# EAGLE design V1_EG7 (EAGLE 7.7.0)
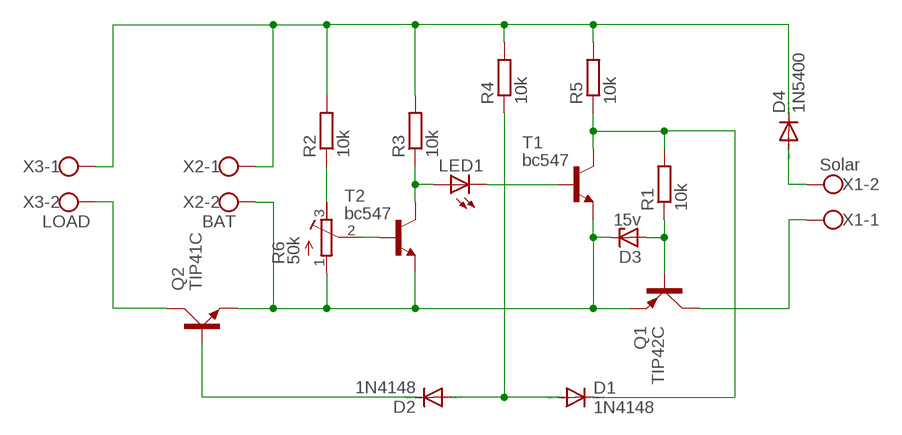
[diagram p0: schematic, sheet 1]

## Parts
D1  1N4148  1N4148DO35-10  [DO35-10]
D2  1N4148  1N4148DO35-10  [DO35-10]
D3  15v  ZENER-DIODEZD-10  [ZDIO-10]
D4  1N5400  [DO201-15]
LED1  LED5MM  [LED5MM]
Q1  TIP42C  [TO220AV]
Q2  TIP41C  [TO220AV]
R1  10k  R-EU_0207/10  [0207/10]
R2  10k  R-EU_0207/10  [0207/10]
R3  10k  R-EU_0207/10  [0207/10]
R4  10k  R-EU_0207/10  [0207/10]
R5  10k  R-EU_0207/10  [0207/10]
R6  50k  R-TRIMM64W  [RTRIM64W]
T1  bc547  BC547-NPN-TO92-CBE  [TO92-CBE]
T2  bc547  BC547-NPN-TO92-CBE  [TO92-CBE]
X1  Solar  W237-102  [W237-102]
X2  BAT  W237-102  [W237-102]
X3  LOAD  W237-102  [W237-102]

## Nets
GND: D3.C Q1.E Q2.E R6.1(A) T1.E T2.E X2.2
N$1: R6.2(S) T2.B
N$2: R2.1 R6.3(E)
N$4: LED1.A R3.1 T2.C
N$5: LED1.K(C) T1.B
N$6: D1.C R1.2 R5.1 T1.C
N$7: D3.A Q1.B R1.1
N$9: D1.A D2.A R4.1
N$10: Q2.C X3.2
N$11: Q1.C X1.1
N$12: D2.C Q2.B
N$13: D4.C R2.2 R3.2 R4.2 R5.2 X2.1 X3.1
N$16: D4.A X1.2

## Library data of the parts
D1 D2 = diode:1N4148: DIODE high speed (Philips)
D3 = diode:ZENER-DIODE: Z-Diode
D4 = diode:1N5400: DIODE standard rectifier, 3 A, 50 V (Motorola)
LED1 = adafruit:LED: LED OSRAM: - CHIPLED LG R971, LG N971, LY N971, LG Q971, LY Q971, LO R971, LY R971 LH N974, LH R974 LS Q976, LO Q976, LY Q976 LO Q996 - Hyper CHIPLED LW Q18S LB Q993, LB Q99A, LB R99A - SideLED LS A670, LO A670, LY A670, LG A670, LP A670 LB A673, LV A673, LT A673, LW A673 LH A674 LY A675 LS A676, LA A676, LO A676, LY A676, LW A676 LS A679, LY A679, LG A679 - Hyper Micro SIDELED® LS Y876, LA Y876, LO Y876, LY Y876 LT Y87S - SmartLED LW L88C, LW L88S LB L89C, LB L89S, LG L890 LS L89K, LO L89K, LY L89K LS L896, LA L896, LO L896, LY L896 - TOPLED LS T670, LO T670, LY T670, LG T670, LP T670 LSG T670, LSP T670, LSY T670, LOP T670, LYG T670 LG T671, LOG T671, LSG T671 LB T673, LV T673, LT T673, LW T673 LH T674 LS T676, LA T676, LO T676, LY T676, LB T676, LH T676, LSB T676, LW T676 LB T67C, LV T67C, LT T67C, LS T67K, LO T67K, LY T67K, LW E67C LS E67B, LA E67B, LO E67B, LY E67B, LB E67C, LV E67C, LT E67C LW T67C LS T679, LY T679, LG T679 LS T770, LO T770, LY T770, LG T770, LP T770 LB T773, LV T773, LT T773, LW T773 LH T774 LS E675, LA E675, LY E675, LS T675 LS T776, LA T776, LO T776, LY T776, LB T776 LHGB T686 LT T68C, LB T68C - Hyper Mini TOPLED® LB M676 - Mini TOPLED Santana® LG M470 LS M47K, LO M47K, LY M47K Source: http://www.osram.convergy.de/
Q1 = transistor-power:TIP42C: PNP TRANSISTOR
Q2 = transistor-power:TIP41C: NPN TRANSISTOR
R1-R5 = rcl:R-EU_: RESISTOR, European symbol; SPICEPREFIX: R
R6 = rcl:R-TRIMM: Trimm resistor; SPICEMODEL: X; SPICEPREFIXL: POT
T1 T2 = DC_LOAD_AU:*-NPN-: NPN Transistror BF959 corrected 2008.03.06
X1-X3 = con-wago-500:W237-102: WAGO SCREW CLAMP; MPN: 237-102; OC_FARNELL: unknown; OC_NEWARK: 70K9898

## Board
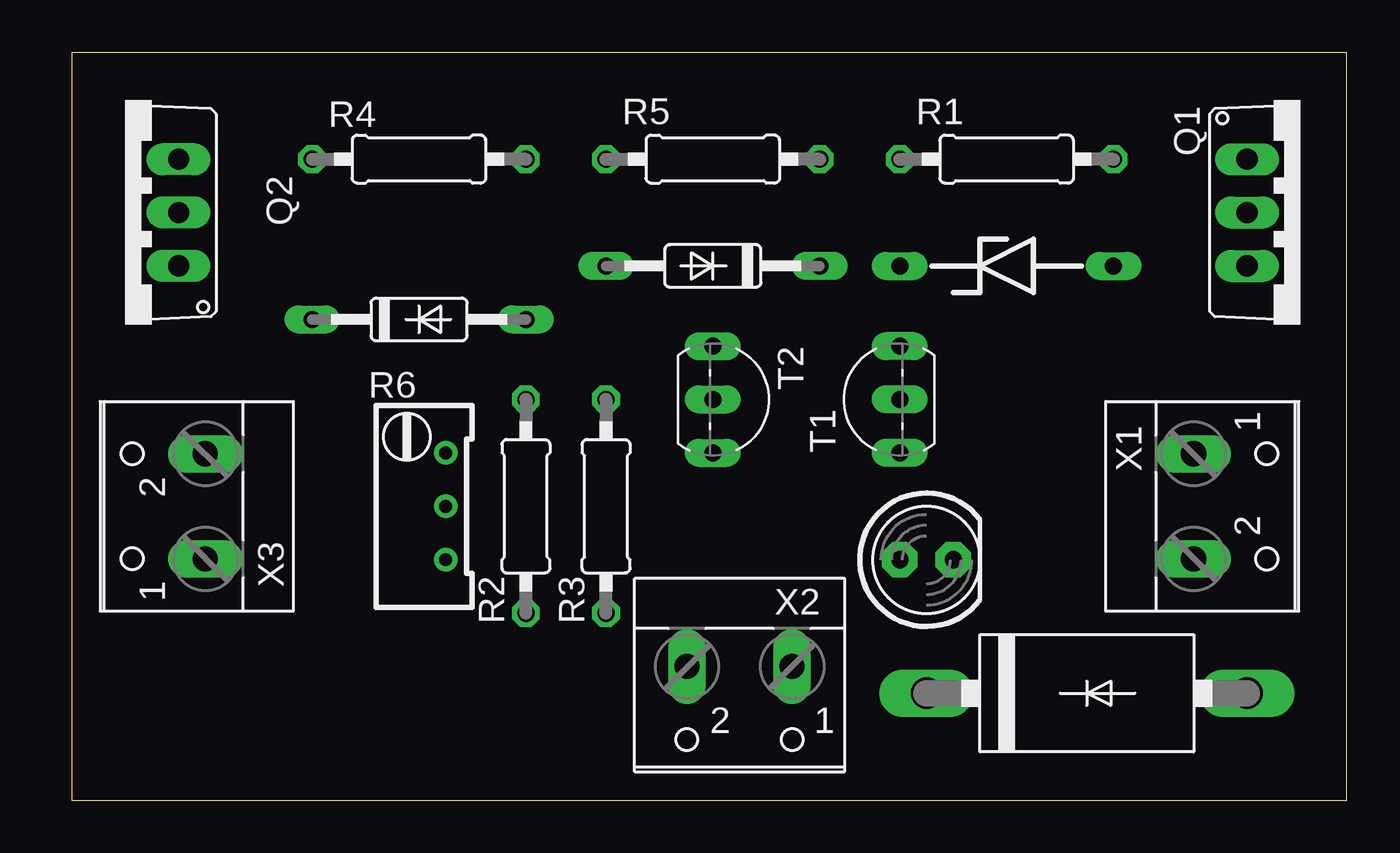
[diagram p1: board, top side]
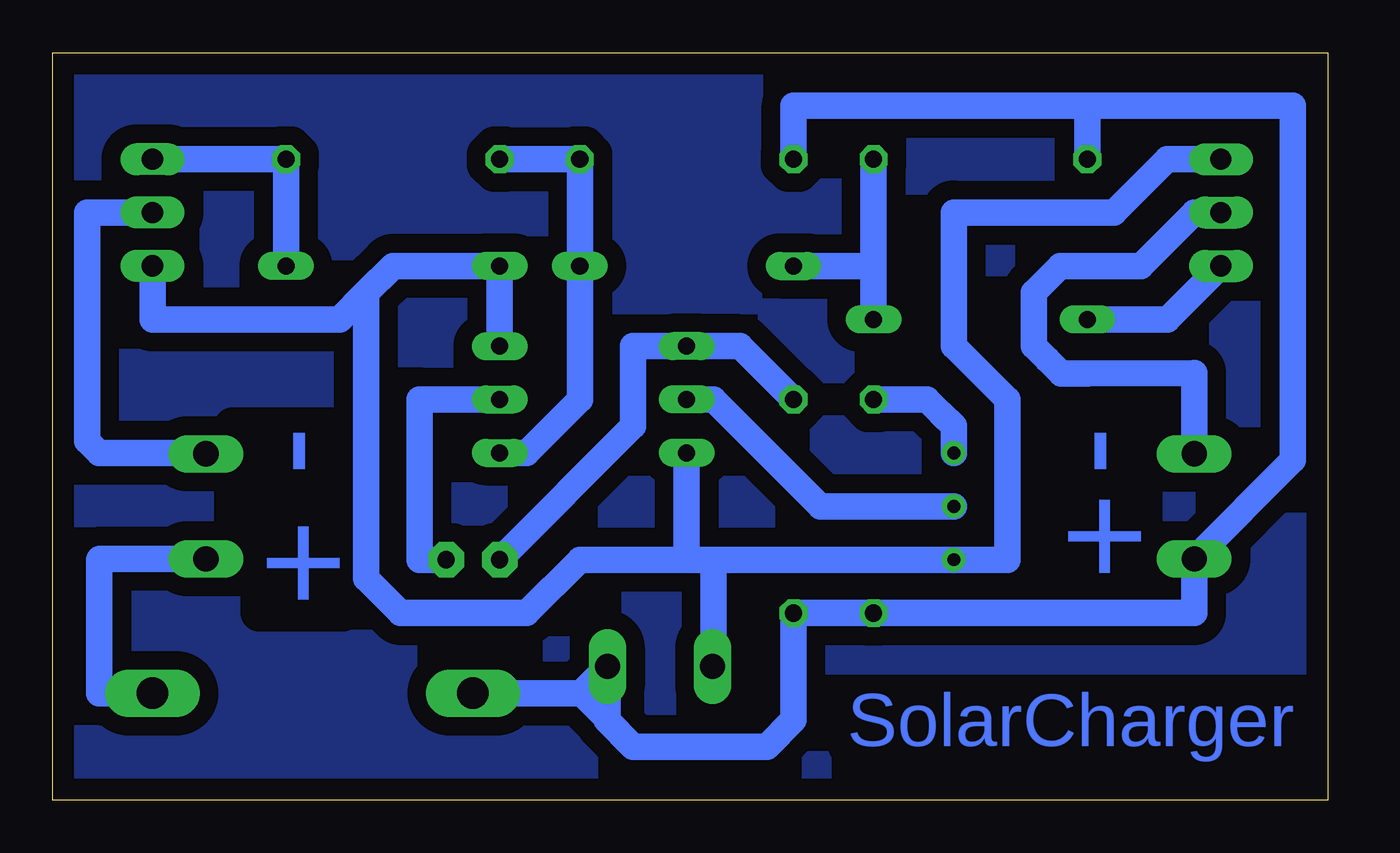
[diagram p2: board, bottom side, seen from below]

Size 60.63 x 35.55 mm. Coordinates in mm from the lower left corner, seen from the top.
Outline: 0,0 60.63,0 60.63,35.55 0,35.55 0,0
Copper layers (1*16): Top 0.035mm / dielectric 1.5mm / Bottom 0.035mm
Design rules "default *": minimum track width 6mil, minimum drill 0.35mm, track to track 35mil, track to pad 35mil, pad to pad 6mil, via to via 6mil, smd to smd 6mil, copper to edge 40mil, drill to drill 6mil, minimum pad ring 10mil, minimum via ring 8mil, stop-mask expansion 4mil, vias tented up to drill 0mil, thermal gap 10mil

### Footprints (pad centres in the part's own frame; a part is rotated, then mirrored left to right if it is on the bottom)
DO35-10 = drill 0.813 long: A 5.08,0; C -5.08,0
ZDIO-10 = drill 0.813 long: A 5.08,0; C -5.08,0
DO201-15 = drill 1.499 long: A 7.62,0; C -7.62,0
LED5MM = drill 0.813 pad 1.676 octagon: A -1.27,0; K 1.27,0
TO220AV = drill 1.016 long: B -2.54,-2.54; C 0,-2.54; E 2.54,-2.54
0207/10 = drill 0.813 octagon: 1 -5.08,0; 2 5.08,0
RTRIM64W = drill 0.61: 1 1.27,-2.54; 2 1.27,0; 3 1.27,2.54
TO92-CBE = drill 0.813 long: B 0,0; C -2.54,0; E 2.54,0
W237-102 = drill 1.194 long: 1 -2.5,-1.27; 2 2.5,-1.27

### Placement (x,y rotation side)
D1  30.48,25.4 180 top
D2  16.51,22.86 0 top
D3  44.45,25.4 0 top
D4  48.26,5.08 0 top
LED1  40.64,11.43 0 top
Q1  58.42,27.94 270 top
Q2  2.54,27.94 90 top
R1  44.45,30.48 180 top
R2  21.59,13.97 270 top
R3  25.4,13.97 270 top
R4  16.51,30.48 180 top
R5  30.48,30.48 180 top
R6  16.51,13.97 0 top
T1  39.37,19.05 90 top
T2  30.48,19.05 270 top
X1  54.61,13.97 270 top
X2  31.75,5.08 180 top
X3  5.08,13.97 90 top

### Tracks (layer width: path | path; a pad name or v marks a point on that pad's centre or on a via)
GND
  Bottom 1.27: T2.E 30.48,11.43 | 29.21,11.43 29.21,6.39 X2.2 | 29.21,11.43 R6.1 15.24,11.43 15.24,19.05 17.78,21.59 17.78,27.94 10.16,27.94 7.62,30.48 Q2.E | 29.21,11.43 30.48,11.43 | T1.E D3.C 44.45,25.4 45.72,24.13 | Q1.E 55.88,22.86 46.99,22.86 45.72,24.13 | 30.48,11.43 35.56,11.43 38.1,8.89 44.08,8.89 45.72,10.53 45.72,24.13
N$1
  Bottom 1.27: R6.2 24.13,13.97 29.21,19.05 T2.B
N$2
  Bottom 1.27: R6.3 17.78,17.78 18.41,18.41 19.05,19.05 R2.1
N$3
  pour Bottom: 60.96,35.56 0,35.56 0,0 60.96,0
N$4
  Bottom 1.27: LED1.A 33.02,17.78 33.02,21.59 T2.C 27.94,21.59 R3.1
N$5
  Bottom 1.27: LED1.K 43.18,11.43 43.18,19.05 T1.B
N$6
  Bottom 1.27: R1.2 R5.1 D1.C 35.56,19.05 38.1,16.51 T1.C
N$7
  Bottom 1.27: D3.A R1.1 Q1.B
N$9
  Bottom 1.27: R4.1 21.59,25.4 | 21.59,25.4 D2.A | D1.A 21.59,25.4
N$10
  Bottom 1.27: X3.2 6.35,20.32 11.43,20.29 12.67,20.29 13.34,20.95 | Q2.C 6.35,27.94 8.89,25.4 12.7,25.4 13.97,24.13 13.97,21.59 13.34,20.95 | 13.34,20.95
N$11
  Bottom 1.27: X1.1 53.38,16.51 58.42,16.51 58.98,17.07 58.98,27.94 Q1.C
N$12
  Bottom 1.27: D2.C 7.62,22.86 Q2.B
N$13
  Bottom 1.27: D4.C 35.52,5.08 | 35.52,5.08 X2.1 34.25,3.85 | 34.25,3.85 34.29,3.81 33.02,2.54 26.67,2.54 25.4,3.81 R3.2 R2.2 6.35,8.89 X3.1 1.65,16.17 1.65,33.02 11.43,33.02 | 11.43,33.02 R4.2 | R5.2 25.4,33.02 11.43,33.02 | 34.25,3.85 35.48,5.08 35.52,5.08
N$16
  Bottom 1.27: X1.2 58.38,11.47 58.42,11.43 58.42,5.08 D4.A

### Text on the board
Bottom: - | - | + | + | SolarCharger
Document: Solar Charger / Dr Essam Nabil
tDocu: - | - | -